# EAGLE design rev2 (EAGLE 7.1.0)
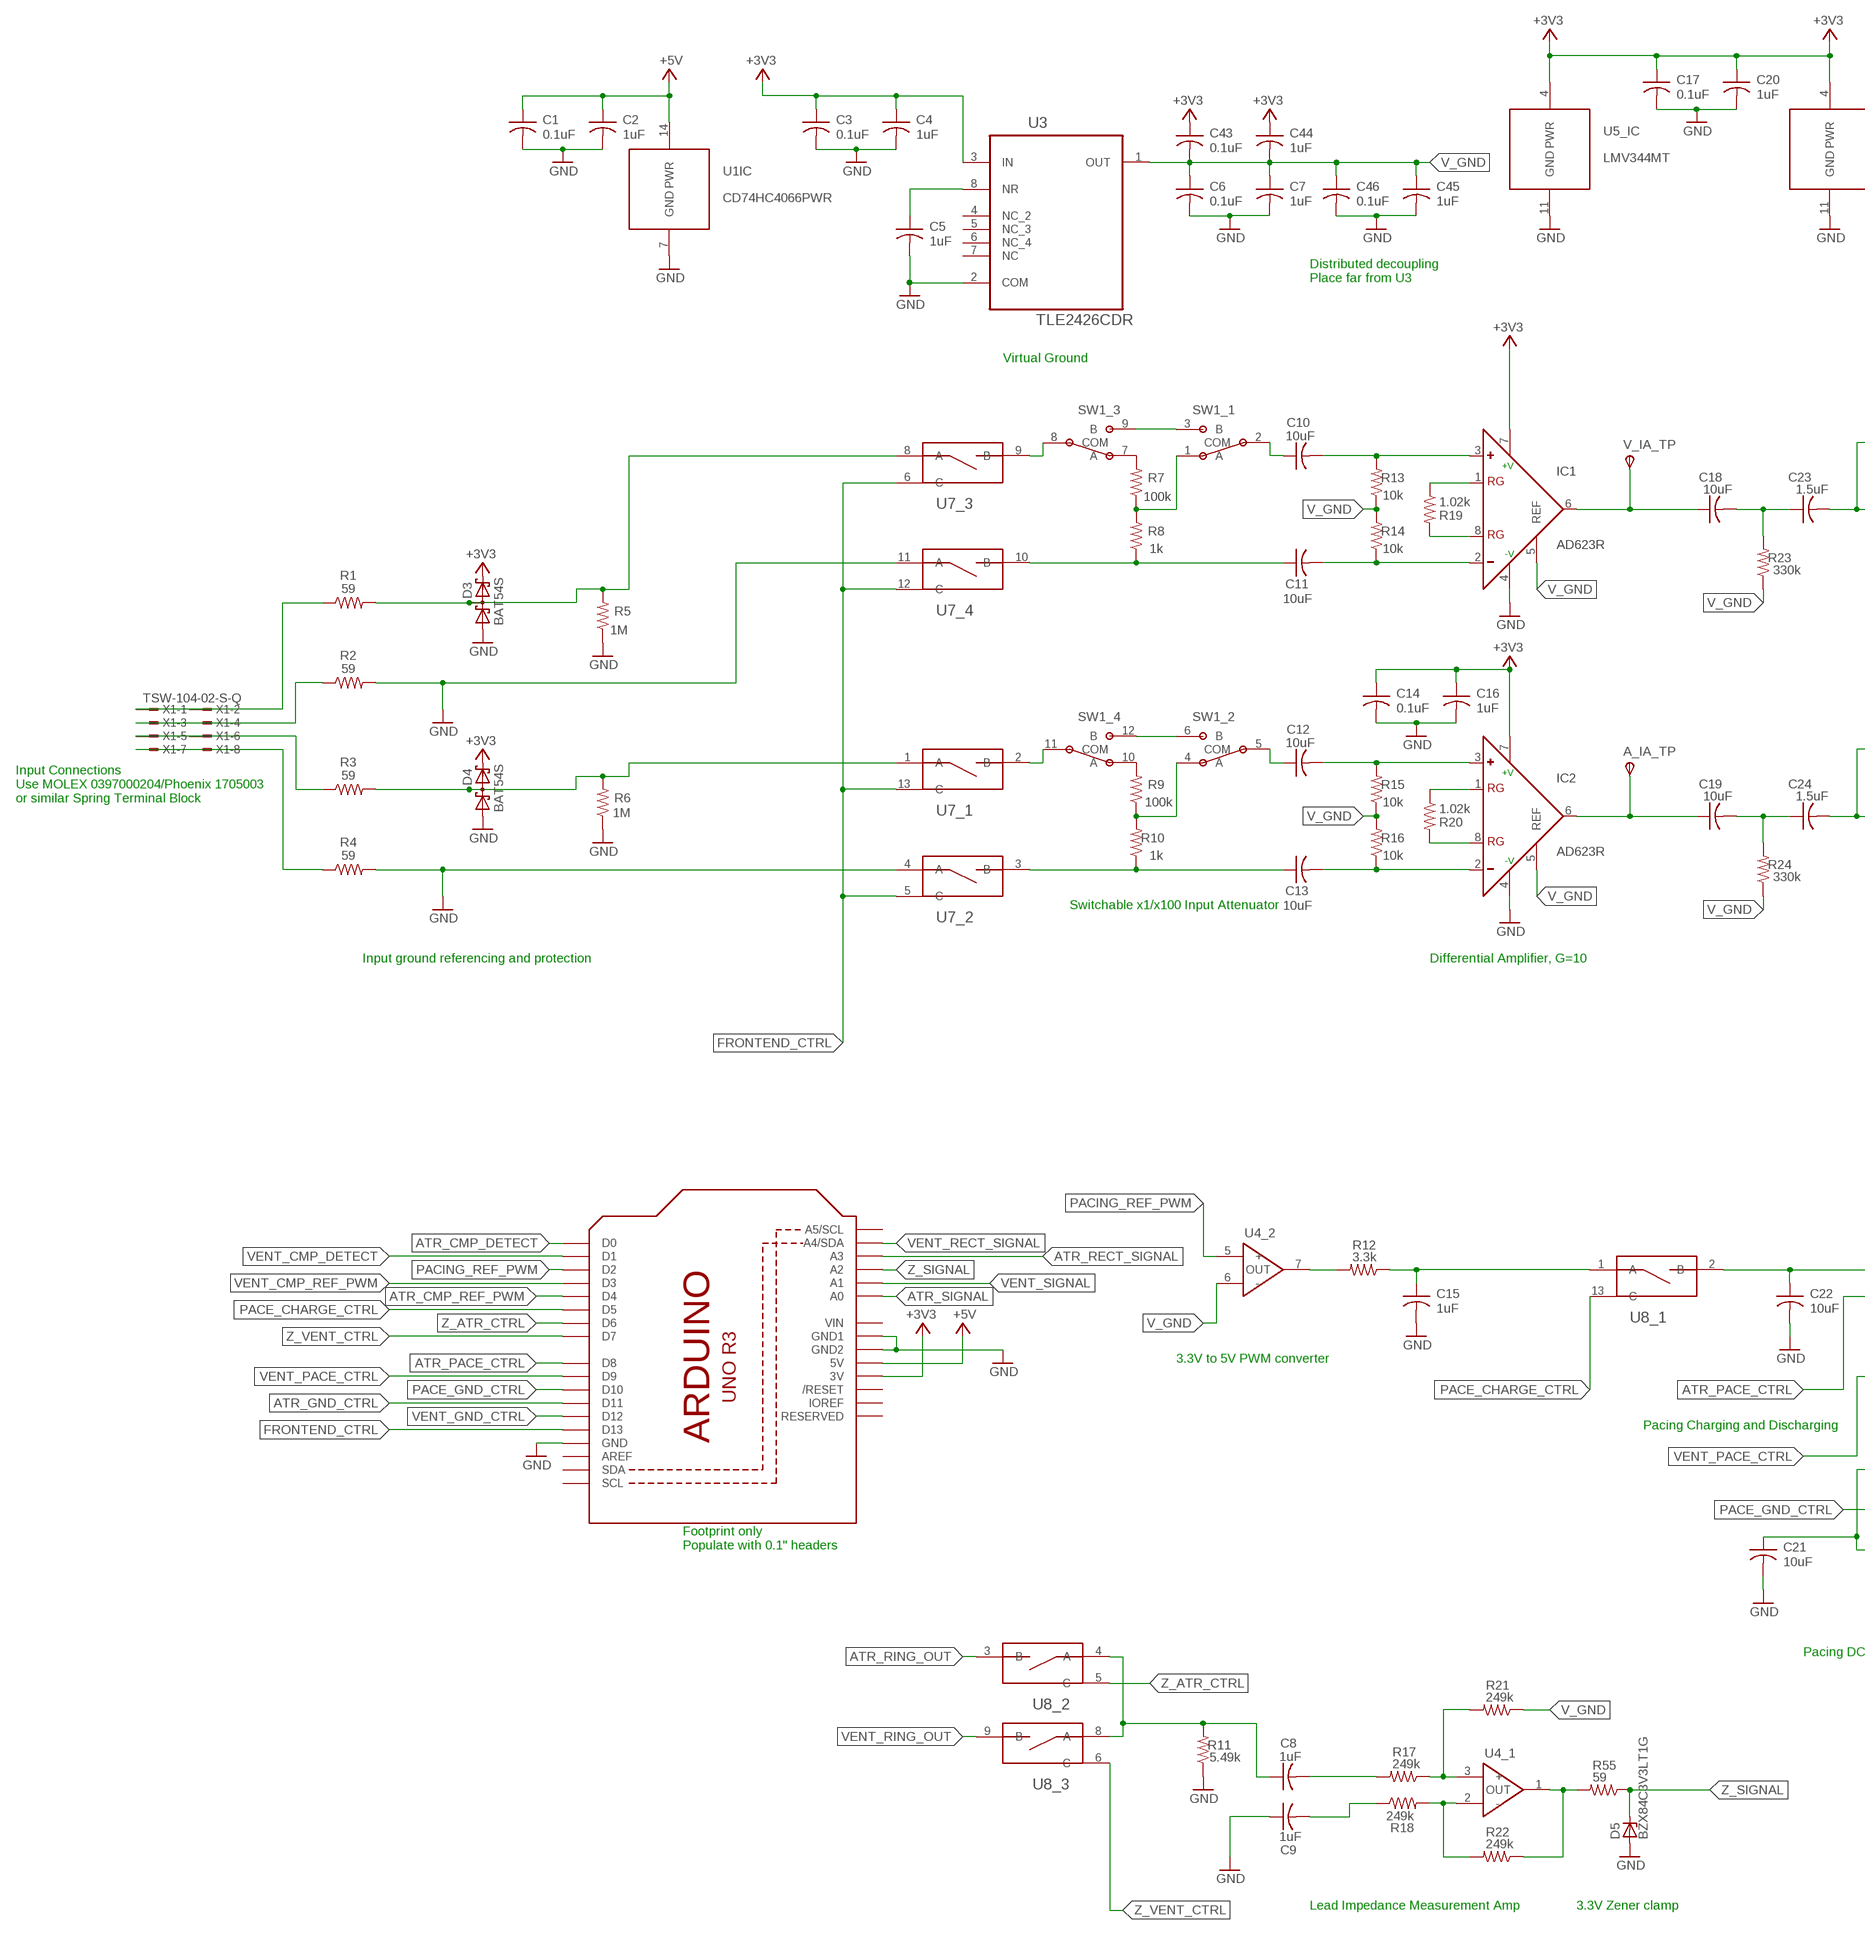
[diagram p0: schematic, sheet 1, part 1 of 2]
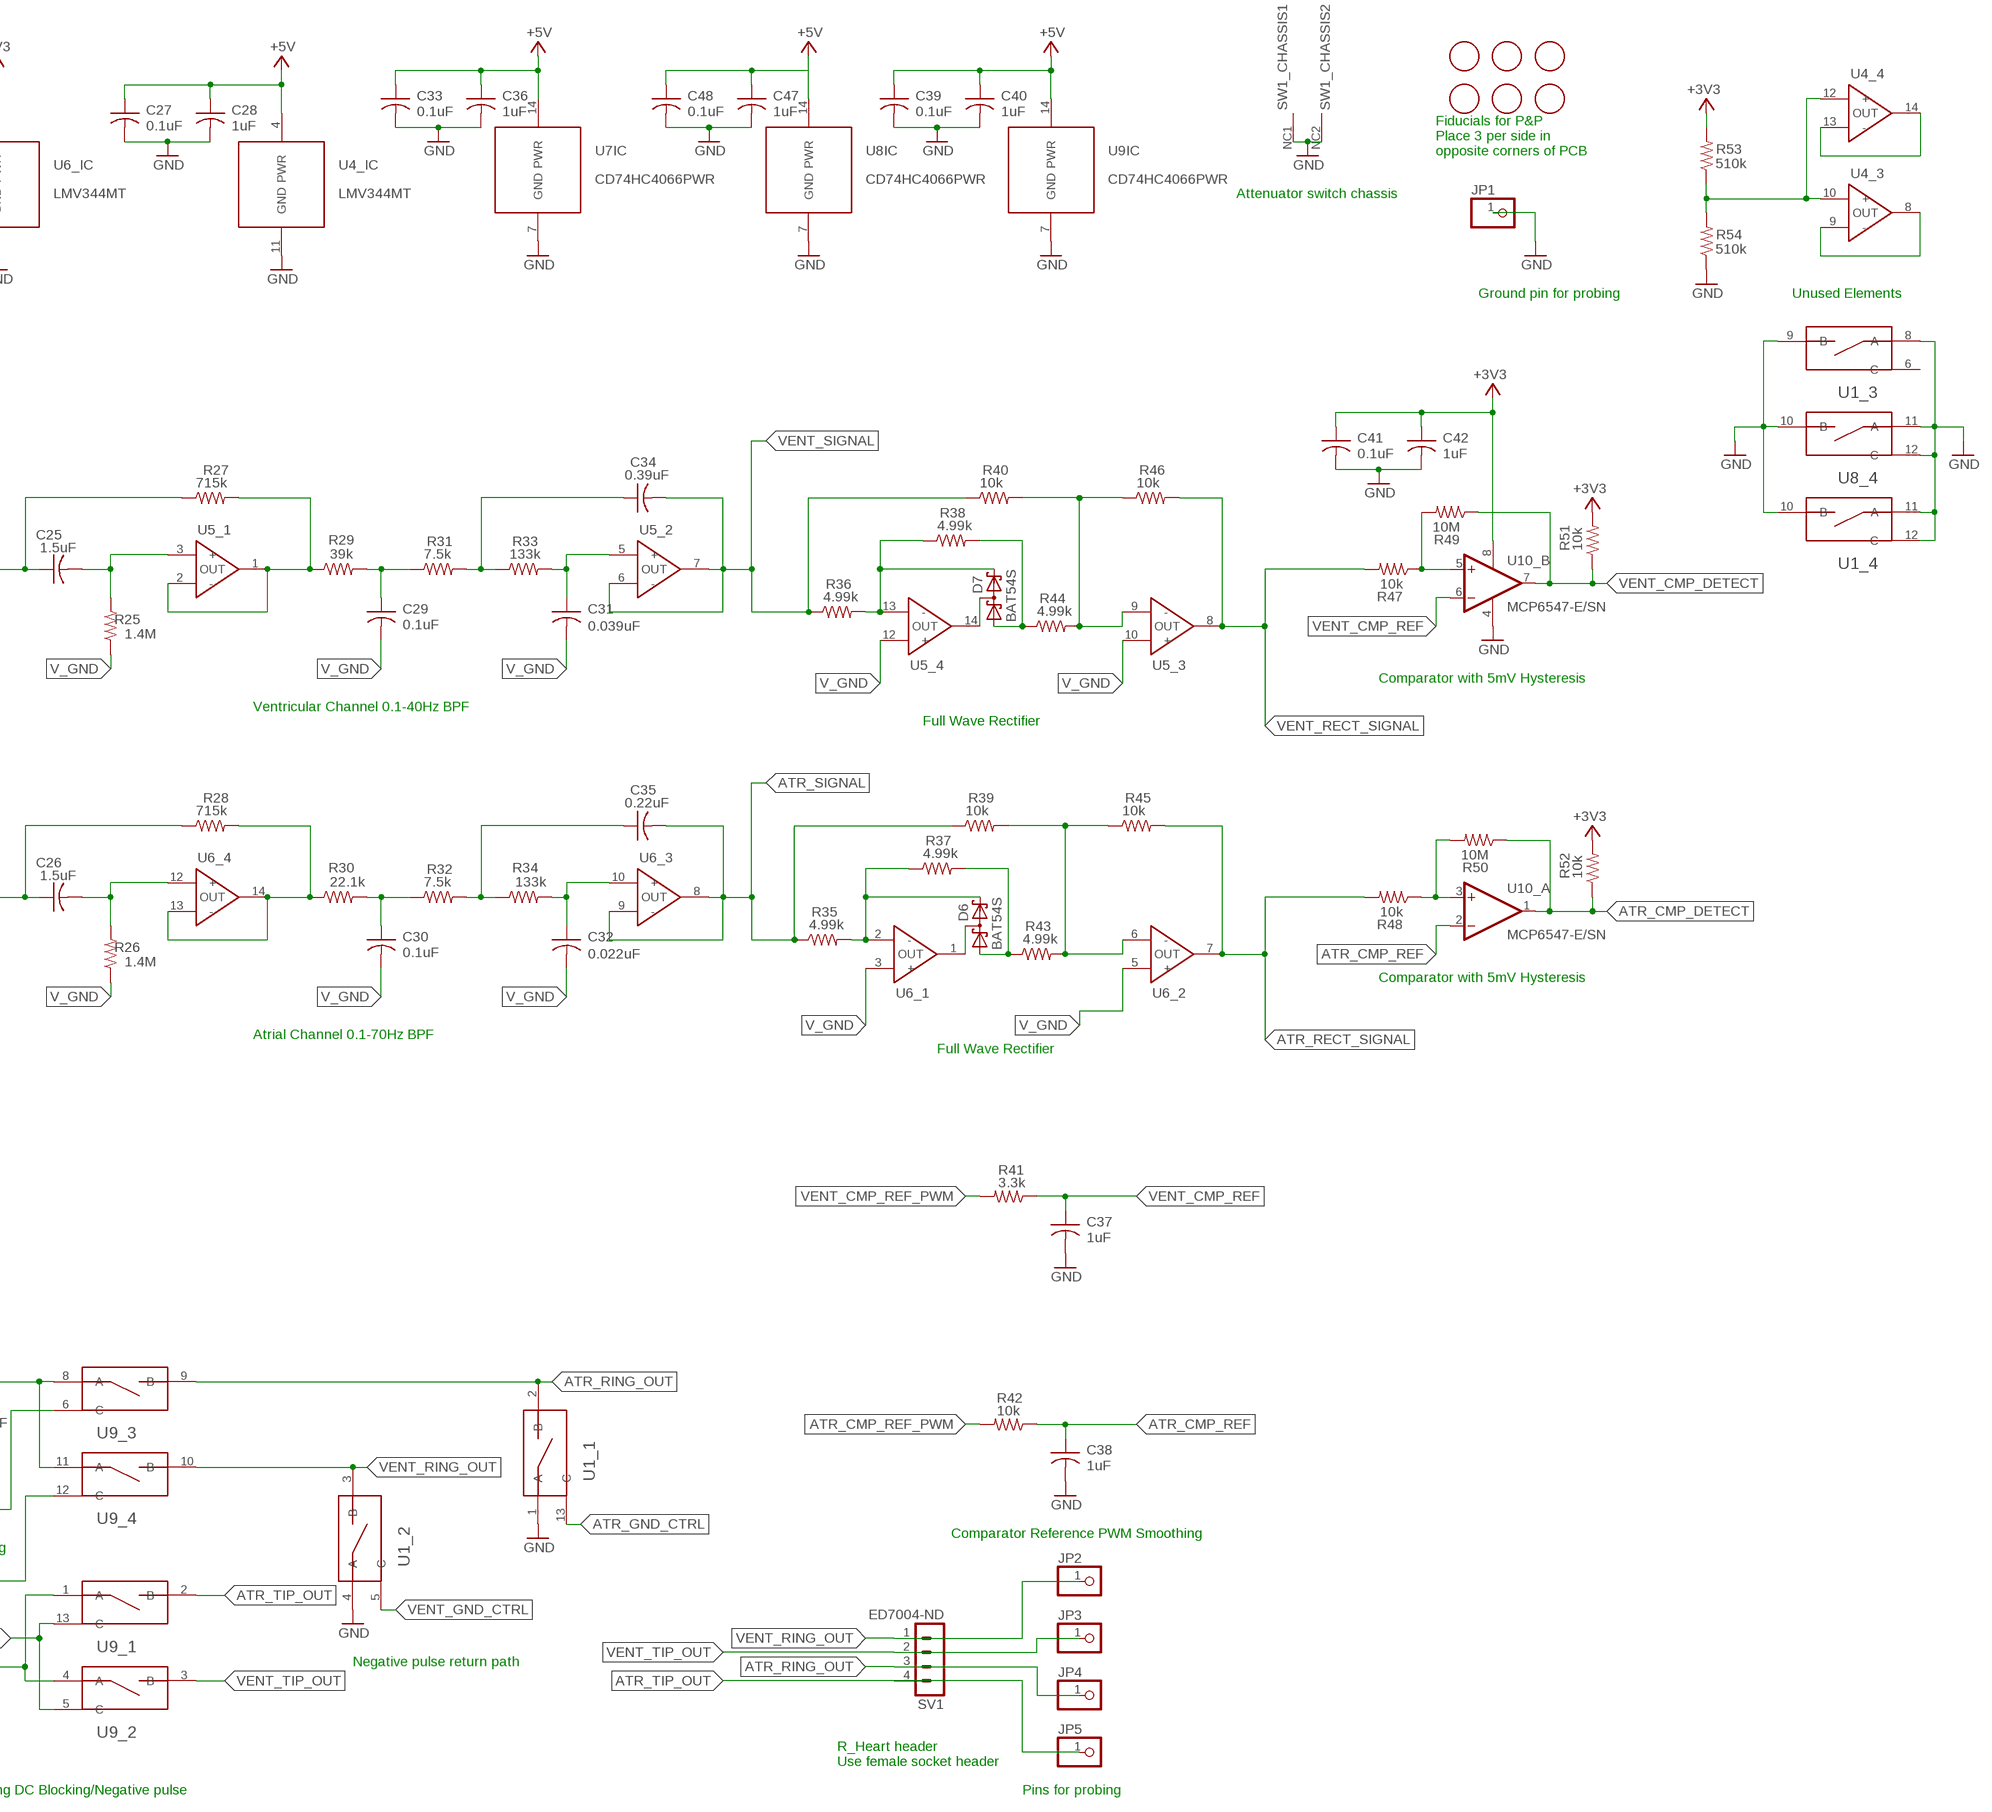
[diagram p1: schematic, sheet 1, part 2 of 2]

## Parts
A_IA_TP  TPSTP06R  [TP06R]
C1  0.1uF  C-USC0805  [C0805]
C2  1uF  C-USC0805  [C0805]
C3  0.1uF  C-USC0805  [C0805]
C4  1uF  C-USC0805  [C0805]
C5  1uF  C-USC0805  [C0805]
C6  0.1uF  C-USC0805  [C0805]
C7  1uF  C-USC0805  [C0805]
C8  1uF  C-USC0805  [C0805]
C9  1uF  C-USC0805  [C0805]
C10  10uF  C-USC0805  [C0805]
C11  10uF  C-USC0805  [C0805]
C12  10uF  C-USC0805  [C0805]
C13  10uF  C-USC0805  [C0805]
C14  0.1uF  C-USC0805  [C0805]
C15  1uF  C-USC0805  [C0805]
C16  1uF  C-USC0805  [C0805]
C17  0.1uF  C-USC0805  [C0805]
C18  10uF  C-USC0805  [C0805]
C19  10uF  C-USC0805  [C0805]
C20  1uF  C-USC0805  [C0805]
C21  10uF  C-USC0805  [C0805]
C22  10uF  C-USC0805  [C0805]
C23  1.5uF  C-USC0805  [C0805]
C24  1.5uF  C-USC0805  [C0805]
C25  1.5uF  C-USC0805  [C0805]
C26  1.5uF  C-USC0805  [C0805]
C27  0.1uF  C-USC0805  [C0805]
C28  1uF  C-USC0805  [C0805]
C29  0.1uF  C-USC0805  [C0805]
C30  0.1uF  C-USC0805  [C0805]
C31  0.039uF  C-USC0805  [C0805]
C32  0.022uF  C-USC0805  [C0805]
C33  0.1uF  C-USC0805  [C0805]
C34  0.39uF  C-USC0805  [C0805]
C35  0.22uF  C-USC0805  [C0805]
C36  1uF  C-USC0805  [C0805]
C37  1uF  C-USC0805  [C0805]
C38  1uF  C-USC0805  [C0805]
C39  0.1uF  C-USC0805  [C0805]
C40  1uF  C-USC0805  [C0805]
C41  0.1uF  C-USC0805  [C0805]
C42  1uF  C-USC0805  [C0805]
C43  0.1uF  C-USC0805  [C0805]
C44  1uF  C-USC0805  [C0805]
C45  1uF  C-USC0805  [C0805]
C46  0.1uF  C-USC0805  [C0805]
C47  1uF  C-USC0805  [C0805]
C48  0.1uF  C-USC0805  [C0805]
D3  BAT54S  [SOT23]
D4  BAT54S  [SOT23]
D5  BZX84C3V3LT1G  ZENER-DIODESOT23  [SOT23]
D6  BAT54S  [SOT23]
D7  BAT54S  [SOT23]
IC1  AD623R  [SO8]
IC2  AD623R  [SO8]
JP1  PINHD-1X1  [1X01]
JP2  PINHD-1X1  [1X01]
JP3  PINHD-1X1  [1X01]
JP4  PINHD-1X1  [1X01]
JP5  PINHD-1X1  [1X01]
R1  59  R-US_R0805  [R0805]
R2  59  R-US_R0805  [R0805]
R3  59  R-US_R0805  [R0805]
R4  59  R-US_R0805  [R0805]
R5  1M  R-US_R0805  [R0805]
R6  1M  R-US_R0805  [R0805]
R7  100k  R-US_R0805  [R0805]
R8  1k  R-US_R0805  [R0805]
R9  100k  R-US_R0805  [R0805]
R10  1k  R-US_R0805  [R0805]
R11  5.49k  R-US_R0805  [R0805]
R12  3.3k  R-US_R0805  [R0805]
R13  10k  R-US_R0805  [R0805]
R14  10k  R-US_R0805  [R0805]
R15  10k  R-US_R0805  [R0805]
R16  10k  R-US_R0805  [R0805]
R17  249k  R-US_R0805  [R0805]
R18  249k  R-US_R0805  [R0805]
R19  1.02k  R-US_R0805  [R0805]
R20  1.02k  R-US_R0805  [R0805]
R21  249k  R-US_R0805  [R0805]
R22  249k  R-US_R0805  [R0805]
R23  330k  R-US_R0805  [R0805]
R24  330k  R-US_R0805  [R0805]
R25  1.4M  R-US_R0805  [R0805]
R26  1.4M  R-US_R0805  [R0805]
R27  715k  R-US_R0805  [R0805]
R28  715k  R-US_R0805  [R0805]
R29  39k  R-US_R0805  [R0805]
R30  22.1k  R-US_R0805  [R0805]
R31  7.5k  R-US_R0805  [R0805]
R32  7.5k  R-US_R0805  [R0805]
R33  133k  R-US_R0805  [R0805]
R34  133k  R-US_R0805  [R0805]
R35  4.99k  R-US_R0805  [R0805]
R36  4.99k  R-US_R0805  [R0805]
R37  4.99k  R-US_R0805  [R0805]
R38  4.99k  R-US_R0805  [R0805]
R39  10k  R-US_R0805  [R0805]
R40  10k  R-US_R0805  [R0805]
R41  3.3k  R-US_R0805  [R0805]
R42  10k  R-US_R0805  [R0805]
R43  4.99k  R-US_R0805  [R0805]
R44  4.99k  R-US_R0805  [R0805]
R45  10k  R-US_R0805  [R0805]
R46  10k  R-US_R0805  [R0805]
R47  10k  R-US_R0805  [R0805]
R48  10k  R-US_R0805  [R0805]
R49  10M  R-US_R0805  [R0805]
R50  10M  R-US_R0805  [R0805]
R51  10k  R-US_R0805  [R0805]
R52  10k  R-US_R0805  [R0805]
R53  510k  R-US_R0805  [R0805]
R54  510k  R-US_R0805  [R0805]
R55  59  R-US_R0805  [R0805]
SV1  ED7004-ND  MA04-1  [MA04-1]
SW1  EG4208  [EG4208-PACKAGE]
U1  CD74HC4066PWR  [SOP65P640X110-14N]
U2  ARDUINOR3-DIMENSION  [ARDUINOR3]
U3  TLE2426CDR  [SOIC127P600X175-8N]
U4  LMV344MT  [SOP65P640X110-14N]
U5  LMV344MT  [SOP65P640X110-14N]
U6  LMV344MT  [SOP65P640X110-14N]
U7  CD74HC4066PWR  [SOP65P640X110-14N]
U8  CD74HC4066PWR  [SOP65P640X110-14N]
U9  CD74HC4066PWR  [SOP65P640X110-14N]
U10  MCP6547-E/SN  [SOIC127P600X175-8N]
U$1  FIDUCIAL  [FIDUCIAL_1MM]
U$2  FIDUCIAL  [FIDUCIAL_1MM]
U$3  FIDUCIAL  [FIDUCIAL_1MM]
U$4  FIDUCIAL  [FIDUCIAL_1MM]
U$5  FIDUCIAL  [FIDUCIAL_1MM]
U$6  FIDUCIAL  [FIDUCIAL_1MM]
V_IA_TP  TPSTP06R  [TP06R]
X1  TSW-104-02-S-Q  [TSW-104-02-S-Q]

## Nets
+3V3: C3.1 C4.1 C14.1 C16.1 C17.1 C20.1 C41.1 C42.1 C43.1 C44.1 D3.2(C2) D4.2(C2) IC1.7(+V) IC2.7(+V) R51.2 R52.2 R53.2 U2.3V U3.3(IN) U5.4(_IC:PWR) U6.4(_IC:PWR) U10.8(_B:V+)
+5V: C1.1 C2.1 C27.1 C28.1 C33.1 C36.1 C39.1 C40.1 C47.1 C48.1 U1.14(IC:PWR) U2.5V U4.4(_IC:PWR) U7.14(IC:PWR) U8.14(IC:PWR) U9.14(IC:PWR)
ATR_CMP_DETECT: R50.1 R52.1 U2.D0 U10.1(_A:OUT)
ATR_CMP_REF: C38.1 R42.1 U10.2(_A:-IN)
ATR_CMP_REF_PWM: R42.2 U2.D4
ATR_GND_CTRL: U1.13(_1:C) U2.D11
ATR_PACE_CTRL: U2.D8 U9.6(_3:C)
ATR_RECT_SIGNAL: R45.2 R48.2 U2.A3 U6.7(_2:OUT)
ATR_RING: D4.3(C1A2) R3.2 R6.2 U7.1(_1:A)
ATR_RING_OUT: JP4.1 SV1.3 U1.2(_1:B) U8.3(_2:B) U9.9(_3:B)
ATR_SIGNAL: C35.2 R35.1 R39.1 U2.A0 U6.8(_3:OUT) U6.9(_3:-)
ATR_TIP_OUT: JP5.1 SV1.4 U9.2(_1:B)
FRONTEND_CTRL: U2.D13 U7.5(_2:C) U7.6(_3:C) U7.12(_4:C) U7.13(_1:C)
GND: C1.2 C2.2 C3.2 C4.2 C5.2 C6.2 C7.2 C9.1 C14.2 C15.2 C16.2 C17.2 C20.2 C21.2 C22.2 C27.2 C28.2 C33.2 C36.2 C37.2 C38.2 C39.2 C40.2 C41.2 C42.2 C45.2 C46.2 C47.2 C48.2 D3.1(A1) D4.1(A1) D5.1(A) IC1.4(-V) IC2.4(-V) JP1.1 R2.2 R4.2 R5.1 R6.1 R11.1 R54.1 SW1.NC1(_CHASSIS1:V-) SW1.NC2(_CHASSIS2:V-) U1.1(_1:A) U1.4(_2:A) U1.7(IC:GND) U1.8(_3:A) U1.9(_3:B) U1.10(_4:B) U1.11(_4:A) U1.12(_4:C) U2.GND U2.GND1 U2.GND2 U3.2(COM) U4.11(_IC:GND) U5.11(_IC:GND) U6.11(_IC:GND) U7.4(_2:A) U7.7(IC:GND) U7.11(_4:A) U8.7(IC:GND) U8.10(_4:B) U8.11(_4:A) U8.12(_4:C) U9.7(IC:GND) U10.4(_B:V-)
N$1: C10.2 IC1.3(+) R13.2
N$2: C11.2 IC1.2(-) R14.1
N$3: C18.1 IC1.6(OUT) V_IA_TP.TP(PP)
N$4: IC1.1(RG) R19.1
N$5: R7.2 SW1.7(_3:A)
N$6: C18.2 C23.1 R23.2
N$7: C23.2 C25.1 R27.1
N$8: C11.1 R8.1 U7.10(_4:B)
N$9: C13.2 IC2.2(-) R16.1
N$10: C29.1 R29.2 R31.1
N$11: C34.1 R31.2 R33.1
N$12: C13.1 R10.1 U7.3(_2:B)
N$13: D6.2(C2) R35.2 R37.1 U6.2(_1:-)
N$15: R9.2 SW1.10(_4:A)
N$16: IC2.1(RG) R20.1
N$17: IC2.8(RG) R20.2
N$18: C19.2 C24.1 R24.2
N$19: D6.3(C1A2) U6.1(_1:OUT)
N$20: IC1.8(RG) R19.2
N$21: C12.2 IC2.3(+) R15.2
N$24: C15.1 R12.1 U8.1(_1:A)
N$25: C21.1 U9.1(_1:A) U9.4(_2:A)
N$26: R22.1 R55.2 U4.1(_1:OUT)
N$27: D7.3(C1A2) U5.14(_4:OUT)
N$28: R28.2 R30.1 U6.13(_4:-) U6.14(_4:OUT)
N$29: SW1.6(_2:B) SW1.12(_4:B)
N$30: C24.2 C26.1 R28.1
N$31: C22.1 U8.2(_1:B) U9.8(_3:A) U9.11(_4:A)
N$32: C25.2 R25.2 U5.3(_1:+)
N$33: R27.2 R29.1 U5.1(_1:OUT) U5.2(_1:-)
N$34: C5.1 U3.8(NR)
N$36: C31.1 R33.2 U5.5(_2:+)
N$40: C30.1 R30.2 R32.1
N$41: R48.1 R50.2 U10.3(_A:+IN)
N$42: C35.1 R32.2 R34.1
N$44: D6.1(A1) R37.2 R43.1
N$45: C26.2 R26.2 U6.12(_4:+)
N$46: R47.1 R49.2 U10.5(_B:+IN)
N$48: C32.1 R34.2 U6.10(_3:+)
N$49: R39.2 R43.2 R45.1 U6.6(_2:-)
N$51: SW1.3(_1:B) SW1.9(_3:B)
N$53: C8.1 R11.2 U8.4(_2:A) U8.8(_3:A)
N$54: A_IA_TP.TP(PP) C19.1 IC2.6(OUT)
N$55: U4.8(_3:OUT) U4.9(_3:-)
N$56: R12.2 U4.7(_2:OUT)
N$57: R17.1 R21.2 U4.3(_1:+)
N$58: R18.2 R22.2 U4.2(_1:-)
N$59: C9.2 R18.1
N$60: C8.2 R17.2
N$61: U4.13(_4:-) U4.14(_4:OUT)
N$62: R53.1 R54.2 U4.10(_3:+) U4.12(_4:+)
N$82: R4.1 X1.7 X1.8
N$83: R2.1 X1.3 X1.4
N$84: R3.1 X1.5 X1.6
N$85: R7.1 R8.2 SW1.1(_1:A)
N$86: R1.1 X1.1 X1.2
N$88: SW1.8(_3:COM) U7.9(_3:B)
N$89: SW1.11(_4:COM) U7.2(_1:B)
N$90: R9.1 R10.2 SW1.4(_2:A)
N$91: D7.2(C2) R36.2 R38.1 U5.13(_4:-)
N$92: C12.1 SW1.5(_2:COM)
N$93: C10.1 SW1.2(_1:COM)
N$94: D7.1(A1) R38.2 R44.1
N$96: R40.2 R44.2 R46.1 U5.9(_3:-)
PACE_CHARGE_CTRL: U2.D5 U8.13(_1:C)
PACE_GND_CTRL: U2.D10 U9.5(_2:C) U9.13(_1:C)
PACING_REF_PWM: U2.D2 U4.5(_2:+)
V_GND: C6.1 C7.1 C29.2 C30.2 C31.2 C32.2 C43.2 C44.2 C45.1 C46.1 IC1.5(REF) IC2.5(REF) R13.1 R14.2 R15.1 R16.2 R21.1 R23.1 R24.1 R25.1 R26.1 U3.1(OUT) U4.6(_2:-) U5.10(_3:+) U5.12(_4:+) U6.3(_1:+) U6.5(_2:+)
VENT_CMP_DETECT: R49.1 R51.1 U2.D1 U10.7(_B:OUT)
VENT_CMP_REF: C37.1 R41.1 U10.6(_B:-IN)
VENT_CMP_REF_PWM: R41.2 U2.D3
VENT_GND_CTRL: U1.5(_2:C) U2.D12
VENT_PACE_CTRL: U2.D9 U9.12(_4:C)
VENT_RECT_SIGNAL: R46.2 R47.2 U2.A4(A4/SDA) U5.8(_3:OUT)
VENT_RING: D3.3(C1A2) R1.2 R5.2 U7.8(_3:A)
VENT_RING_OUT: JP2.1 SV1.1 U1.3(_2:B) U8.9(_3:B) U9.10(_4:B)
VENT_SIGNAL: C34.2 R36.1 R40.1 U2.A1 U5.6(_2:-) U5.7(_2:OUT)
VENT_TIP_OUT: JP3.1 SV1.2 U9.3(_2:B)
Z_ATR_CTRL: U2.D6 U8.5(_2:C)
Z_SIGNAL: D5.3(C) R55.1 U2.A2
Z_VENT_CTRL: U2.D7 U8.6(_3:C)
Unconnected: U1.6(_3:C) U2.A5(A5/SCL) U2.AREF U2.IOREF U2.RESERVED U2.RESET(/RESET) U2.SCL U2.SDA U3.4(NC_2) U3.5(NC_3) U3.6(NC_4) U3.7(NC)

## Notes on the sheet
- Fiducials for P&P
  Place 3 per side in 
  opposite corners of PCB
- Attenuator switch chassis
- Ground pin for probing | Unused Elements
- Distributed decoupling
  Place far from U3
- Virtual Ground
- Comparator with 5mV Hysteresis
- Ventricular Channel 0.1-40Hz BPF
- Full Wave Rectifier
- Input Connections
  Use MOLEX 0397000204/Phoenix 1705003
  or similar Spring Terminal Block
- Comparator with 5mV Hysteresis
- Switchable x1/x100 Input Attenuator
- Atrial Channel 0.1-70Hz BPF
- Input ground referencing and protection | Differential Amplifier, G=10 | Full Wave Rectifier
- 3.3V to 5V PWM converter
- Comparator Reference PWM Smoothing
- Pacing Charging and Discharging
- Negative pulse return path
- Footprint only
  Populate with 0.1" headers
- R_Heart header
  Use female socket header
- Pacing DC Blocking/Negative pulse | Pins for probing
- Lead Impedance Measurement Amp | 3.3V Zener clamp

## Power pins joined to a net without a drawn wire
VIN: U2.VIN

## Library data of the parts
A_IA_TP V_IA_TP = testpad:TPS: TEST PIN
C1-C48 = adafruit:C-US: CAPACITOR, American symbol
D3 D4 D6 D7 = diode:BAT54S: Schottky Diodes Pin connection corrected 2011-05-04 Source: Fairchild .. BAT54.pdf
D5 = diode:ZENER-DIODE: Z-Diode
IC1 IC2 = analog-devices:AD623: Single-Supply, Rail-to-Rail, Low Cost Instrumentation Amplifier Source: http://www.analog.com/static/imported-files/data_sheets/AD623.pdf; MPN: AD623ARZ.; OC_FARNELL: 9426213; OC_NEWARK: 31M4186
JP1-JP5 = pinhead:PINHD-1X1: PIN HEADER
R1-R55 = adafruit:R-US_: RESISTOR, American symbol
SV1 = con-lstb:MA04-1: PIN HEADER; OC_FARNELL: unknown; OC_NEWARK: unknown
SW1 = semi_custom_parts:EG4208
U1 U7-U9 = semi_custom_parts:CD74HC4066PWR
U2 = adafruit:ARDUINOR3: This is a new object for the new Arduino R3 - with extra pins that you may want to use (such as IOref, and duplicated A4/A5
U3 = Texas Instruments_By_element14_Batch_1:TLE2426CDR: Precision Virtual Ground; MPN: TLE2426CDR; OC_FARNELL: 1575632; OC_NEWARK: 76C7712; PACKAGE: SOIC-8; SUPPLIER: Texas Instruments
U4-U6 = semi_custom_parts:LMV344MT
U10 = semi_custom_parts:MCP6547-E/SN: Open-Drain Output Sub-Microamp Comparators; MPN: MCP6547-E/SN; OC_FARNELL: -; OC_NEWARK: 71J5347; PACKAGE: SOIC-8; SUPPLIER: Microchip
U$1-U$6 = adafruit:FIDUCIAL: For use by pick and place machines to calibrate the vision/machine, 1mm By microbuilder.eu
X1 = con-samtec:TSW-104-02-S-Q: THROUGH-HOLE .025" SQ POST HEADER Source: Samtec TSW.pdf; OC_FARNELL: unknown; OC_NEWARK: unknown

## Board
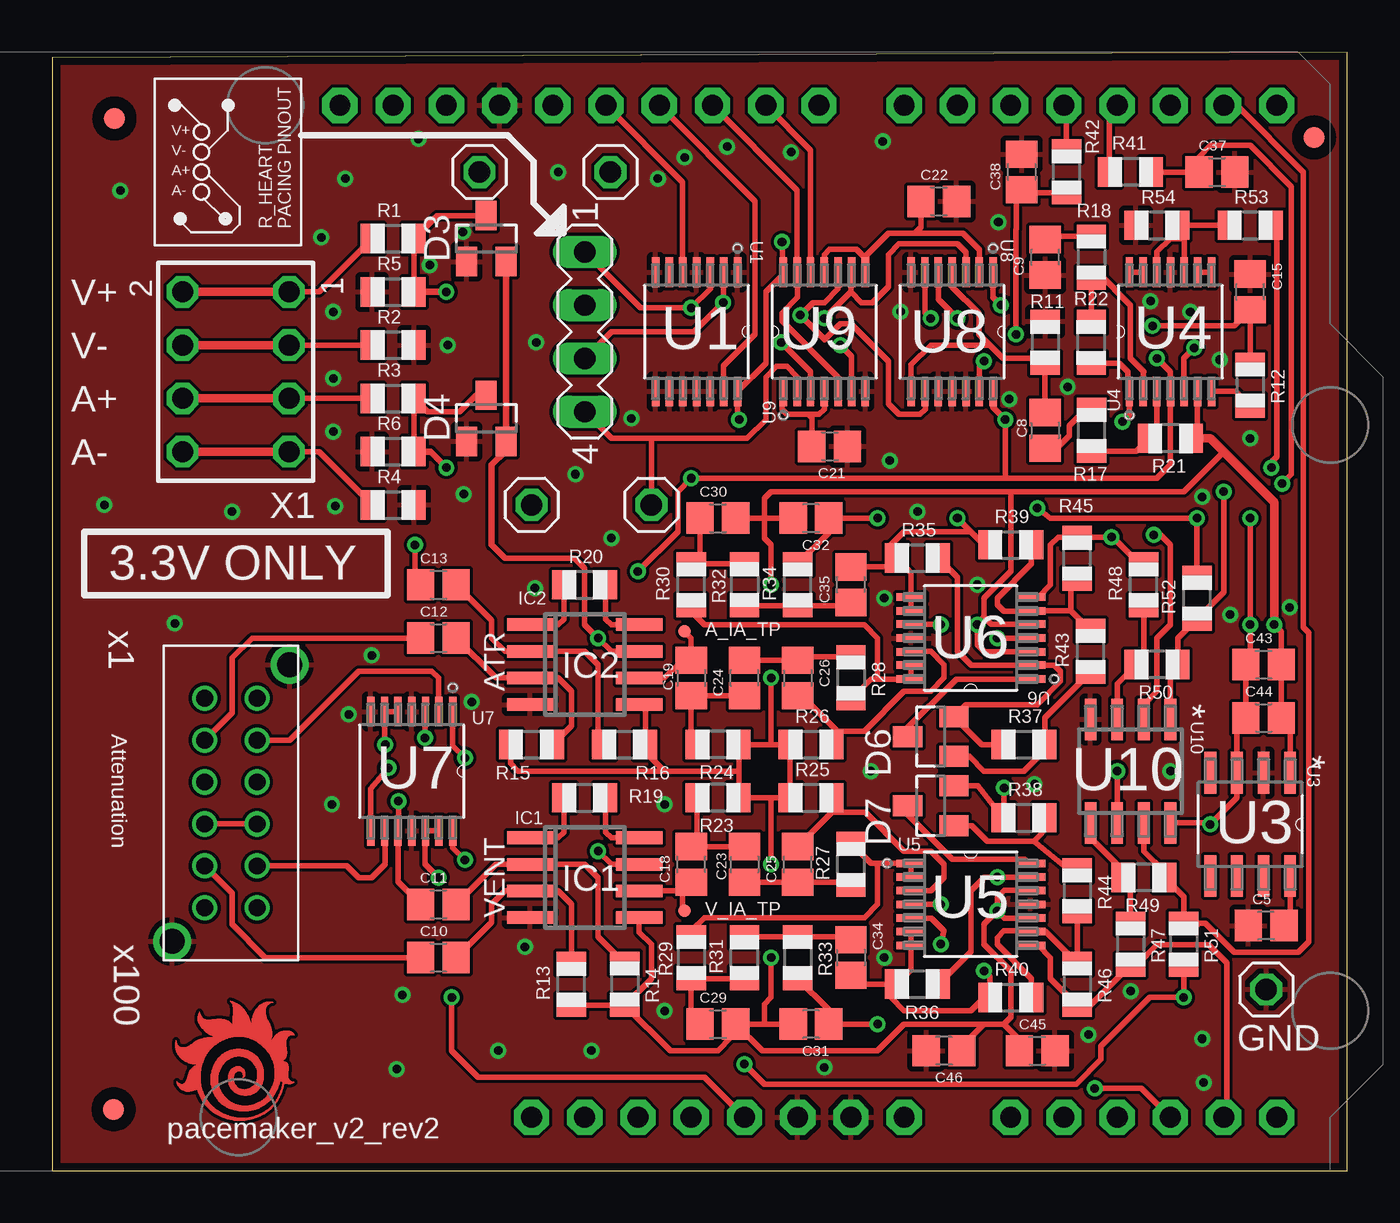
[diagram p2: board, top side]
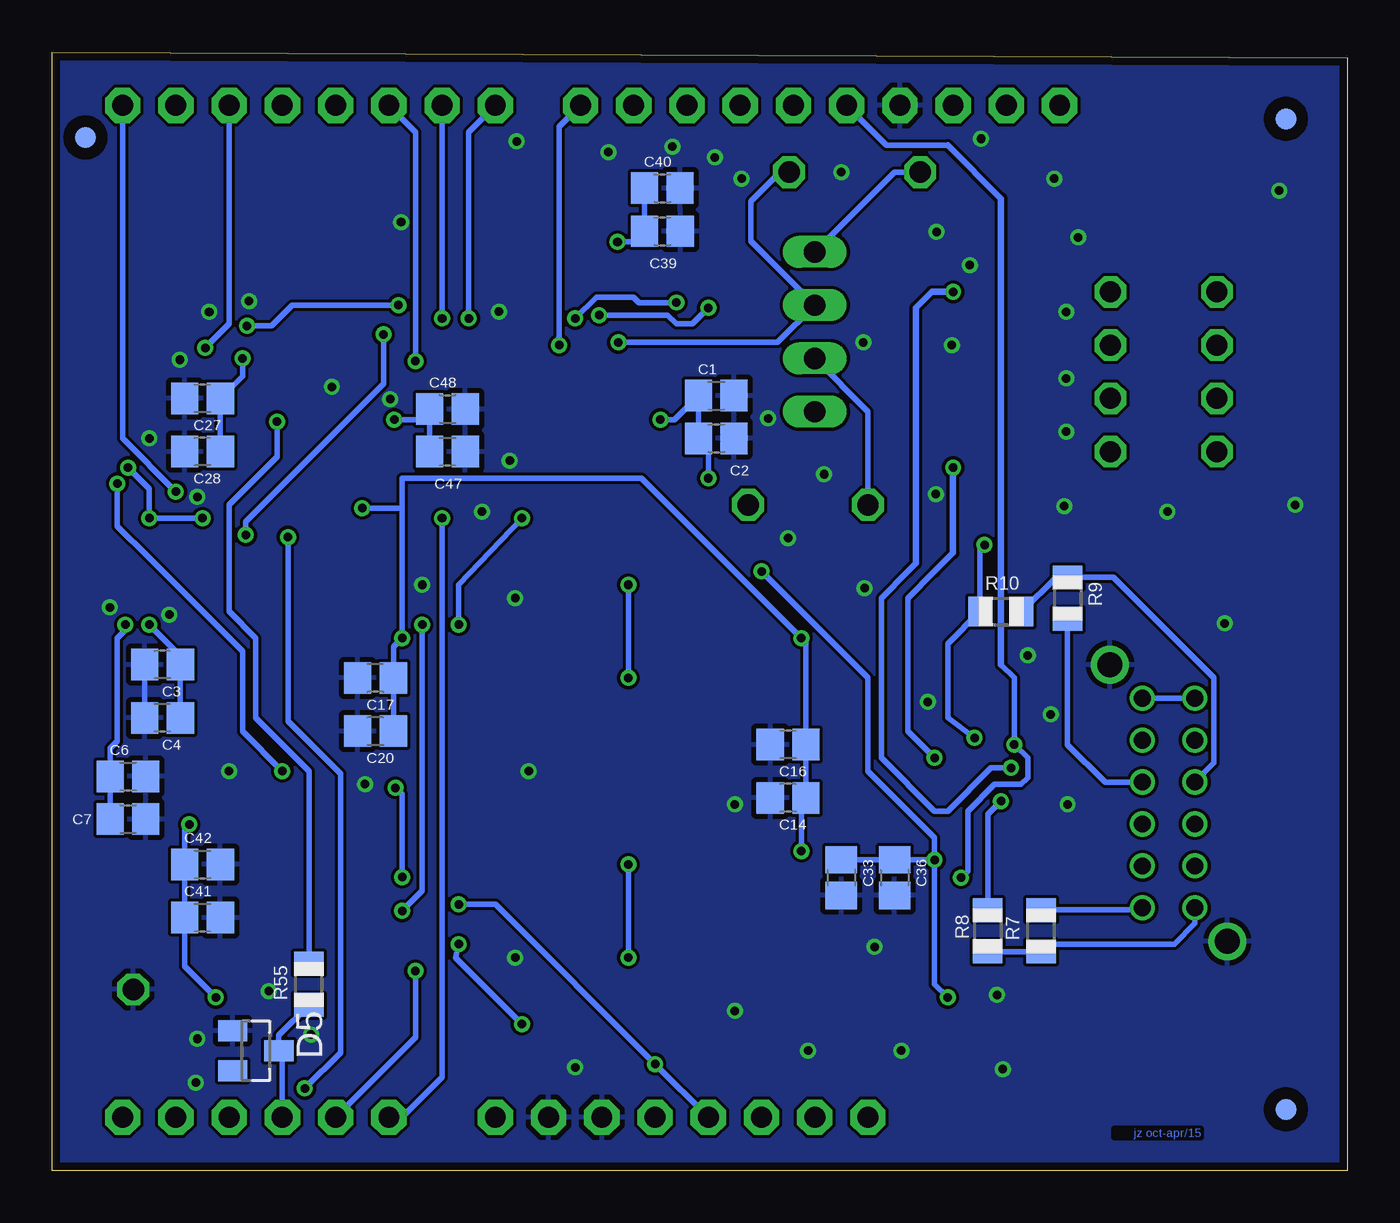
[diagram p3: board, bottom side, seen from below]

Size 61.77 x 53.33 mm. Coordinates in mm from the lower left corner, seen from the top.
Outline: 0,0 61.77,0 61.77,53.33 0,53.08 0,0
Copper layers (1*16): Top 0.0356mm / dielectric 1.5011mm / Bottom 0.0356mm
Design rules "oshpark-2layer *": minimum track width 6mil, minimum drill 13mil, track to track 6mil, track to pad 6mil, pad to pad 6mil, via to via 6mil, smd to smd 6mil, copper to edge 15mil, drill to drill 6mil, minimum pad ring 7mil, minimum via ring 7mil, stop-mask expansion 4mil, vias tented up to drill 100mil, thermal gap 10mil

### Footprints (pad centres in the part's own frame; a part is rotated, then mirrored left to right if it is on the bottom)
TP06R = smd 0.6 x 0.6: TP 0,0
C0805 = smd 1.3 x 1.5: 1 -0.85,0; 2 0.85,0
SOT23 = smd 1 x 1.4: 1 -0.95,-1.1; 2 0.95,-1.1; 3 0,1.1
SO8 = smd 0.6 x 2.2: 1 -1.905,-2.6; 2 -0.635,-2.6; 3 0.635,-2.6; 4 1.905,-2.6; 5 1.905,2.6; 6 0.635,2.6; 7 -0.635,2.6; 8 -1.905,2.6
1X01 = drill 1.016 octagon: 1 0,0
R0805 = smd 1.1 x 1.4: 1 -1,0; 2 1,0
MA04-1 = drill 1.016 long: 1 -3.81,0; 2 -1.27,0; 3 1.27,0; 4 3.81,0
EG4208-PACKAGE = drill 0.8: 1 -1.55,11.6; 2 -1.55,9.6; 3 -1.55,7.6; 4 -1.55,5.6; 5 -1.55,3.6; 6 -1.55,1.6; 7 -4.05,11.6; 8 -4.05,9.6; 9 -4.05,7.6; 10 -4.05,5.6; 11 -4.05,3.6; 12 -4.05,1.6 | drill 1.2: NC1 0,13.2; NC2 -5.6,0
SOP65P640X110-14N = smd 1.422 x 0.356: 1 -2.845,1.956; 2 -2.845,1.295; 3 -2.845,0.66; 4 -2.845,0; 5 -2.845,-0.66; 6 -2.845,-1.295; 7 -2.845,-1.956; 8 2.845,-1.956; 9 2.845,-1.295; 10 2.845,-0.66; 11 2.845,0; 12 2.845,0.66; 13 2.845,1.295; 14 2.845,1.956
ARDUINOR3 = drill 1 pad 1.676 octagon: 3V 35.56,2.54; 5V 38.1,2.54; A0 50.8,2.54; A1 53.34,2.54; A2 55.88,2.54; A3 58.42,2.54; A4 60.96,2.54; A5 63.5,2.54; AREF 23.876,50.8; D0 63.5,50.8; D1 60.96,50.8; D2 58.42,50.8; D3 55.88,50.8; D4 53.34,50.8; D5 50.8,50.8; D6 48.26,50.8; D7 45.72,50.8; D8 41.656,50.8; D9 39.116,50.8; D10 36.576,50.8; D11 34.036,50.8; D12 31.496,50.8; D13 28.956,50.8; GND 26.416,50.8; GND1 43.18,2.54; GND2 40.64,2.54; IOREF 30.48,2.54; RESERVED 27.94,2.54; RESET 33.02,2.54; SCL 18.796,50.8; SDA 21.336,50.8; VIN 45.72,2.54
SOIC127P600X175-8N = smd 1.981 x 0.559: 1 -2.464,1.905; 2 -2.464,0.635; 3 -2.464,-0.635; 4 -2.464,-1.905; 5 2.464,-1.905; 6 2.464,-0.635; 7 2.464,0.635; 8 2.464,1.905
FIDUCIAL_1MM = smd 1 x 1: 1 0,0
TSW-104-02-S-Q = drill 1 pad 1.5 octagon: 1 3.81,-2.54; 2 3.81,2.54; 3 1.27,-2.54; 4 1.27,2.54; 5 -1.27,-2.54; 6 -1.27,2.54; 7 -3.81,-2.54; 8 -3.81,2.54

### Placement (x,y rotation side)
A_IA_TP  30.16,25.72 0 top
C1  30.1,36.96 0 bottom
C2  30.1,34.93 0 bottom
C3  56.52,24.13 180 bottom
C4  56.52,21.59 180 bottom
C5  57.91,11.68 180 top
C6  58.17,18.8 0 bottom
C7  58.17,16.76 0 bottom
C8  47.36,35.31 270 top
C9  47.37,43.56 90 top
C10  18.41,10.16 0 top
C11  18.41,12.7 0 top
C12  18.41,25.4 0 top
C13  18.41,27.94 0 top
C14  26.67,17.78 180 bottom
C15  57.15,41.91 90 top
C16  26.67,20.32 180 bottom
C17  46.36,23.49 180 bottom
C18  30.48,14.6 90 top
C19  30.48,23.49 270 top
C20  46.36,20.95 180 bottom
C21  37.08,34.54 0 top
C22  42.29,46.23 0 top
C23  33.02,14.6 270 top
C24  33.02,23.49 90 top
C25  35.56,14.6 90 top
C26  35.56,23.49 270 top
C27  54.61,36.83 180 bottom
C28  54.61,34.29 180 bottom
C29  31.75,6.98 0 top
C30  31.75,31.12 0 top
C31  36.2,6.98 180 top
C32  36.2,31.12 180 top
C33  24.13,13.97 270 bottom
C34  38.1,10.16 270 top
C35  38.1,27.94 90 top
C36  21.59,13.97 270 bottom
C37  55.56,47.62 0 top
C38  46.25,47.62 90 top
C39  32.67,44.8 0 bottom
C40  32.68,46.85 0 bottom
C41  54.61,12.06 0 bottom
C42  54.61,14.6 0 bottom
C43  57.78,24.13 0 top
C44  57.78,21.59 0 top
C45  46.99,5.71 0 top
C46  42.55,5.71 180 top
C47  42.93,34.29 0 bottom
C48  42.93,36.32 0 bottom
D3  20.7,44.45 0 top
D4  20.7,35.88 0 top
D5  52.07,5.71 270 bottom
D6  41.91,20.7 90 top
D7  41.91,17.4 90 top
IC1  25.4,13.97 270 top
IC2  25.4,24.13 270 top
JP1  57.91,8.64 0 top
JP2  20.37,47.62 0 top
JP3  26.62,47.62 0 top
JP4  22.86,31.75 0 top
JP5  28.58,31.75 0 top
R1  16.26,44.45 0 top
R2  16.26,39.37 0 top
R3  16.26,36.83 0 top
R4  16.26,31.75 0 top
R5  16.26,41.91 0 top
R6  16.26,34.29 0 top
R7  14.6,11.43 90 bottom
R8  17.14,11.43 270 bottom
R9  13.33,27.3 270 bottom
R10  16.51,26.67 0 bottom
R11  47.37,39.5 270 top
R12  57.15,37.47 270 top
R13  24.77,8.89 90 top
R14  27.3,8.89 270 top
R15  22.86,20.32 0 top
R16  27.3,20.32 0 top
R17  49.58,35.31 90 top
R18  49.57,43.56 270 top
R19  25.4,17.78 0 top
R20  25.4,27.94 0 top
R21  53.34,34.93 180 top
R22  49.57,39.5 90 top
R23  31.75,17.78 180 top
R24  31.75,20.32 180 top
R25  36.2,17.78 0 top
R26  36.2,20.32 0 top
R27  38.1,14.6 90 top
R28  38.1,23.49 270 top
R29  30.48,10.16 270 top
R30  30.48,27.94 90 top
R31  33.02,10.16 90 top
R32  33.02,27.94 270 top
R33  35.56,10.16 270 top
R34  35.56,27.94 90 top
R35  41.27,29.21 0 top
R36  41.27,8.89 0 top
R37  46.36,20.32 0 top
R38  46.36,16.83 0 top
R39  45.72,29.84 0 top
R40  45.72,8.26 0 top
R41  51.44,47.62 180 top
R42  48.39,47.64 90 top
R43  49.53,24.77 90 top
R44  48.9,13.33 270 top
R45  48.9,29.21 90 top
R46  48.9,8.89 270 top
R47  51.44,10.79 270 top
R48  52.07,27.94 90 top
R49  52.07,13.97 180 top
R50  52.7,24.13 180 top
R51  53.97,10.79 270 top
R52  54.61,27.3 90 top
R53  57.15,45.09 0 top
R54  52.7,45.09 0 top
R55  49.53,8.89 90 bottom
SV1  25.4,40.01 270 top
SW1  5.71,24.13 180 top
U1  30.73,40.01 270 top
U2  -5.08,0 0 top
U3  57.15,16.51 270 top
U4  53.34,40.01 90 top
U5  43.81,12.7 0 top
U6  43.81,25.4 180 top
U7  17.14,19.05 270 top
U8  42.93,40.01 270 top
U9  36.83,40.01 90 top
U10  51.44,19.05 270 top
U$1  2.92,2.92 0 top
U$2  60.2,49.28 0 top
U$3  2.92,50.16 0 bottom
U$4  2.92,2.92 0 bottom
U$5  2.96,50.18 0 top
U$6  60.2,49.28 0 bottom
U$7  [FIREBALL]  9.03,4.92 0 top
V_IA_TP  30.16,12.38 0 top
X1  8.75,38.1 90 top

### Tracks (layer width: path | path; a pad name or v marks a point on that pad's centre or on a via)
+3V3  (via drill 0.41 pad 0.25)
  Top 0.254: IC2.7 26.67,24.77 v26.04,25.4 25.4,26.03 25.4,28.73 24.92,29.21 21.59,29.21 20.95,29.84 | v26.04,15.24 26.67,14.6 IC1.7 | R53.2 58.42,44.82 58.42,34.04 58.17,33.78 v58.17,33.53 | v57.15,31.12 v57.15,26.03 57.15,24.34 C43.1 C44.1 56.52,21.17 U3.3 56.52,17.78 55.32,16.59 | R52.2 v54.61,31.12 47.62,31.12 v46.99,31.59 | U6.4 v45.09,25.4 | U10.8 55.32,16.59 | U5.4 v42.39,12.7 | 55.32,16.59 v55.25,16.51 | R51.2 v53.97,8.26 52.36,8.26 50.03,5.92 50.03,5.31 48.85,4.13 33.97,4.13 v33.02,5.08 | D3.2 21.8,43.35
  Top 0.305: 20.95,29.84 20.95,33.66 21.59,34.29 21.59,34.72 D4.2 D3.2
  Bottom 0.254: C4.1 C3.1 55.67,24.55 v57.15,26.03 | v54.61,31.12 v57.15,31.12 57.15,32.51 v58.17,33.53 | v42.39,12.7 40.64,12.7 v33.02,5.08 U2.3V | v53.97,8.26 55.46,9.74 C41.1 C42.1 55.46,16.3 v55.25,16.51 | v26.04,15.24 26.04,17.56 C14.1 C16.1 25.82,25.19 v26.04,25.4 33.66,33.02 45.09,33.02 45.09,31.59 | C20.1 C17.1 45.51,24.98 v45.09,25.4 45.09,31.59 | v46.99,31.59 45.09,31.59
+5V  (via drill 0.41 pad 0.25)
  Top 0.254: v19.05,8.26 19.05,5.71 20.32,4.45 31.12,4.45 U2.5V | v52.7,38.73 53.34,38.1 U4.4 53.34,33.66 52.7,33.02 45.47,33.02 | 45.47,33.02 v30.48,33.02 29.84,32.39 29.84,30.48 v27.94,28.58 | 19.1,15.5 U7.14 19.1,15.4 v19.69,14.82 | U8.14 44.88,36.4 v45.47,35.81 45.47,33.02 | v34.81,44.29 34.89,42.86 U9.14 34.87,42.75 34.04,41.91 34.04,38.51 U1.14 32.69,35.89 v32.77,35.81
  Bottom 0.254: 19.69,14.92 19.69,15.87 22.86,19.05 22.86,23.49 v27.94,28.58 | 19.69,14.92 v19.69,14.82 | v19.69,14.82 19.69,8.89 v19.05,8.26 | v52.7,38.73 52.7,37.89 C27.1 C28.1 | C33.1 C36.1 19.79,14.82 | 19.79,14.82 19.69,14.92 | v19.69,14.82 19.79,14.82 | v45.47,35.81 44.28,35.81 C48.1 C47.1 | C40.1 33.52,46.84 C39.1 34.02,44.29 v34.81,44.29 | v32.77,35.81 32.09,35.81 C1.1 C2.1 30.48,34.46 v30.48,33.02
ATR_CMP_DETECT  (via drill 0.41 pad 0.25)
  Top 0.254: U10.1 53.34,23.86 R50.1 53.7,25.4 R52.1 55.88,27.58 v55.88,32.39
  Bottom 0.254: U2.D0 58.42,34.93 v55.88,32.39
ATR_CMP_REF  (via drill 0.41 pad 0.25)
  Top 0.254: U10.2 52.07,22.23 52.7,22.86 52.7,25.4 53.34,26.03 53.34,29.84 52.86,30.32 v52.55,30.32 | R42.1 46.39,46.64 C38.1 46,46.52 46,44.92 45.97,44.89 v45.97,39.88
  Bottom 0.254: v52.55,30.32 52.55,30.96 45.97,37.53 v45.97,39.88
ATR_CMP_REF_PWM
  Top 0.254: R42.2 48.39,50.67 U2.D4
ATR_GND_CTRL
  Top 0.254: U2.D11 33.53,46.23 33.53,39.88 32.03,38.38 U1.13
ATR_PACE_CTRL  (via drill 0.41 pad 0.25)
  Top 0.254: U9.6 38.12,38.84 v37.59,39.37
  Bottom 0.254: 37.47,49.91 U2.D8 37.59,49.78 v37.59,39.37
ATR_RECT_SIGNAL  (via drill 0.41 pad 0.25)
  Top 0.254: R45.2 47.99,30.21 47.62,29.84 47.62,27.94 47.04,27.36 U6.7 | R48.2 51.86,28.94 50.59,30.21 v50.53,30.21 50.03,30.21 R45.2 | 48.94,30.16 R45.2 | U2.A3 51.96,3.92 v49.73,3.92
  Bottom 0.254: v49.73,3.92 48.03,5.62 48.03,18.92 50.53,21.42 v50.53,30.21
ATR_RING  (via drill 0.41 pad 0.25)
  Top 0.254: R6.2 R3.2 17.89,36.2 19.43,36.2 20.21,36.98 D4.3 | U7.1 19.1,20.27 v19.69,19.69
  Top 0.305: v18.8,33.53 18.03,34.29 R6.2
  Bottom 0.254: v19.69,19.69 20.95,20.95 20.95,27.3 19.69,28.58
  Bottom 0.305: 19.69,28.58 18.8,29.46 v18.8,33.53
ATR_RING_OUT  (via drill 0.41 pad 0.25)
  Top 0.254: U8.3 43.59,43.79 43.18,44.2 40.39,44.2 39.88,43.69 39.88,42.16 39.12,41.4 38.61,41.4 38.1,41.91 | 38.1,41.91 38.1,42.82 U9.9 | v36.83,40.64 38.1,41.91 | U1.2 32.03,41.43 v32,41.4 30.61,40.01 26.67,40.01 SV1.3
  Bottom 0.254: v36.83,40.64 35.81,41.66 34.04,41.66 33.78,41.4 v32,41.4 | SV1.3 22.86,36.2 JP4.1
ATR_SIGNAL  (via drill 0.41 pad 0.25)
  Top 0.254: C35.2 39.86,28.79 R35.1 | U6.9 U6.8 40.97,28.52 R35.1 | R39.1 44.45,29.84 43.81,30.48 | 43.81,30.48 40.64,30.48 40.01,29.84 40.01,29.48 R35.1 | 43.81,30.48 v43.18,31.12
  Bottom 0.254: U2.A0 45.09,2.54 43.18,4.45 v43.18,31.12
ATR_TIP_OUT
  Top 0.254: 28.58,34.93 33.15,34.93 34.04,35.81 34.04,37.85 34.54,38.35 35.05,38.35 35.54,37.87 U9.2 | 28.58,34.93 26.67,34.93 SV1.4 | JP5.1 28.58,34.93
FRONTEND_CTRL  (via drill 0.41 pad 0.25)
  Top 0.254: U7.13 U7.12 17.78,15.58 17.78,14.6 v18.41,13.97 | U7.5 U7.6 15.85,20.34 v15.87,20.32
  Bottom 0.254: U2.D13 21.97,48.9 19.05,48.9 | 16.51,24.13 15.87,23.49 v15.87,20.32 15.24,19.69 15.24,18.73 15.56,18.41 16.83,18.41 18.1,17.15 18.1,14.29 v18.41,13.97
  Bottom 0.305: 19.05,48.9 16.51,46.36 16.51,24.13
GND  (via drill 0.41 pad 0.25)
  Top 0.254: 22.86,12.01 IC1.4
  Bottom 0.254: C4.2 C3.2
  other vias: 24.13,47.62 45.14,45.24 54.29,40.96 52.39,41.47 55.69,38.67 35.24,48.58 32.19,48.83 28.89,47.31 17.46,49.21 13.4,40.96 13.4,37.78 13.4,35.24 8.57,31.43 23.08,39.5 19.59,44.77 13.49,31.69 19.62,32.26 18,43.18 39.69,27.3 39.05,19.05 29.21,17.46 29.21,7.62 41.27,31.43 44.13,27.94 57.15,34.93 59.03,26.86 53.34,19.05 46.86,18.43 56.2,26.51 54.93,4.19 54.86,6.29 22.54,10.67 25.72,5.71 21.27,5.71 36.83,4.92 13.33,17.46 15.24,24.57 5.84,26.1 12.83,44.51 13.97,47.31 26.67,30.16 24.96,33.21 39.62,49.09 39.69,10.16 16.43,4.84 49.43,6.48 23.02,27.78 51.45,8.55 14.13,21.76 48.44,37.38 54.86,32.13 45.66,36.79 39.95,33.86 40.46,40.97 30.16,48.32 27.62,35.88 18.86,39.37 16.7,8.38 20,22.35 3.24,46.74 2.48,31.75
  pour Top: -20.15,64.71 -20.15,-5.22 85.31,-5.22 85.31,68.47 -20.28,68.47
  pour Bottom: -17.6,66.85 -17.6,-3.2 81.95,-3.2 81.95,67.12 -15.72,67.12
N$1
  Top 0.254: R13.2 24.77,12.7 24.13,13.33 IC1.3 21.59,13.33 20.95,12.7 20.95,11.85 C10.2
N$2
  Top 0.254: R14.1 26.04,11.16 26.04,13.97 25.4,14.6 IC1.2 21.17,14.6 C11.2
N$3
  Top 0.254: IC1.6 30.06,13.33 | 30.06,13.33 C18.1 | V_IA_TP.TP 30.06,12.49 30.06,13.33
N$4
  Top 0.254: R19.1 24.4,16.15 24.13,15.87 IC1.1
N$5
  Bottom 0.254: R7.2 9.87,12.43 SW1.7
N$6
  Top 0.254: R23.2 30.75,15.72 C18.2 C23.1
N$7
  Top 0.254: C23.2 C25.1 37.95,13.76 R27.1
N$8  (via drill 0.41 pad 0.25)
  Top 0.254: C11.1 16.48,13.78 U7.10 16.51,15.62 v16.51,17.62
  Bottom 0.254: R8.1 17.14,16.99 v16.51,17.62
N$9
  Top 0.254: R16.1 26.04,20.59 26.04,24.13 25.4,24.77 IC2.2 21.59,24.77 20.95,25.4 20.95,26.25 C13.2
N$10
  Top 0.254: C29.1 30.48,7.4 R29.2 R31.1
N$11
  Top 0.254: R31.2 R33.1 37.95,11.16 C34.1
N$12  (via drill 0.41 pad 0.25)
  Top 0.254: C13.1 17.14,27.94 17.3,28.1 17.3,28.7 v17.3,29.84 | v17.78,20.64 17.78,22.48 U7.3
  Bottom 0.254: v17.78,20.64 19.05,21.59 19.05,25.13 R10.1 17.51,29.64 v17.3,29.84
N$13
  Top 0.254: R37.1 44.34,20.32 D6.2 43.58,22.23 46.99,22.23 48.1,23.34 48.1,23.81 47.81,24.1 U6.2 43.84,24.1 43.18,24.77 43.18,28.3 R35.2
N$15
  Bottom 0.254: SW1.10 11.54,18.53 13.33,20.32 R9.2
N$16
  Top 0.254: R20.1 24.4,26.3 24.13,26.03 IC2.1
N$17
  Top 0.254: R20.2 26.4,26.3 26.67,26.03 IC2.8
N$18
  Top 0.254: C24.1 C19.2 30.48,20.59 R24.2
N$19
  Top 0.254: U6.1 43.13,23.44 40.64,20.95 40.64,20.87 D6.3
N$20
  Top 0.254: R19.2 26.4,16.15 26.67,15.87 IC1.8
N$21
  Top 0.254: R15.2 24.77,21.23 24.77,22.86 24.13,23.49 IC2.3 21.17,23.49 C12.2
N$24  (via drill 0.41 pad 0.25)
  Top 0.254: R12.1 C15.1 56.38,40.29 v52.48,40.29 | U8.1 44.88,41.66 v45.26,41.27
  Bottom 0.254: v52.48,40.29 51.31,40.29 50.32,41.27 v45.26,41.27
N$25
  Top 0.254: U9.4 36.83,36.32 36.58,36.07 36.07,36.07 | 36.07,36.07 35.05,36.07 34.8,36.32 34.8,37.08 U9.1 | C21.1 36.23,35.9 36.07,36.07
N$26  (via drill 0.41 pad 0.25)
  Top 0.254: v51.05,35.72 51.38,36.05 U4.1 51.31,37.24 51.31,38.1 50.91,38.5 R22.1
  Bottom 0.254: v51.05,35.72 51.05,34.04 53.34,31.75 53.34,26.67 52.07,25.4 52.07,21.59 49.53,19.05 R55.2
N$27
  Top 0.254: D7.3 40.81,16.98 42.94,14.84 46.37,14.84 46.61,14.6 U5.14
N$28
  Top 0.254: R28.2 39.05,23.44 39.37,23.44 | 39.37,23.44 U6.14 U6.13 | R30.1 30.48,26.67 31.12,26.03 38.73,26.03 39.37,25.4 39.37,23.44
N$29
  Bottom 0.254: SW1.6 SW1.12
N$30
  Top 0.254: R28.1 35.71,24.49 C26.1 C24.2
N$31
  Top 0.254: U8.2 44.22,43.92 43.43,44.7 41.15,44.7 | 41.15,44.7 39.88,44.7 38.86,43.69 38.86,42.93 U9.8 38.79,43.51 38.35,43.94 37.08,43.94 36.83,43.69 U9.11 | C22.1 41.44,45 41.15,44.7
N$32
  Top 0.254: R25.2 37.2,17.09 | 37.2,17.09 C25.2 | 37.2,17.09 38.79,17.09 40.64,15.24 41.91,15.24 42.55,14.6 42.55,13.97 41.91,13.33 41,13.33 U5.3
N$33
  Top 0.254: 39.37,14.66 U5.1 U5.2 | 39.37,14.66 39.05,14.66 R27.2 | R29.1 30.48,11.43 31.12,12.06 38.73,12.06 39.37,12.7 39.37,14.66
N$34
  Top 0.254: U3.8 59.06,11.98 C5.1
N$36  (via drill 0.41 pad 0.25, 0.41 pad 0.3)
  Top 0.254: R33.2 37.05,7.68 C31.1 v39.37,6.98 | U5.5 41.94,12.04 42.55,11.43 v42.39,10.79
  Bottom 0.254: v39.37,6.98 42.55,10.16 v42.39,10.79
N$40
  Top 0.254: C30.1 30.9,29.36 R30.2 R32.1
N$41
  Top 0.254: U10.3 50.8,23.23 R50.2 | 51.44,24.49 R50.2 | R48.1 52.07,24.49 R50.2
N$42
  Top 0.254: R32.2 R34.1 37.95,26.94 C35.1
N$44
  Top 0.254: D6.1 43.75,19.75 44.45,19.05 46.36,19.05 46.99,19.69 46.99,19.95 R37.2 47.36,21.59 R43.1
N$45
  Top 0.254: C26.2 35.77,22.65 37.47,20.95 | 37.47,20.95 37.47,20.59 R26.2 | 37.47,20.95 38.73,20.95 40.64,22.86 41.91,22.86 42.55,23.49 42.55,24.13 41.91,24.77 41,24.77 U6.12
N$46
  Top 0.254: R47.1 51.44,13.6 R49.2 51.07,14.33 49.53,15.87 U10.5
N$48  (via drill 0.41 pad 0.25)
  Top 0.254: R34.2 37.05,30.43 C32.1 v39.37,31.12 | U6.10 42.52,26.06 v42.39,26.03
  Bottom 0.254: v42.39,26.03 42.39,27.94 v39.37,31.12
N$49
  Top 0.254: 48.6,26.7 U6.6 46.63,26.67 45.4,26.67 45.09,26.99 45.09,27.3 46.72,28.94 R39.2 | 48.6,26.7 R43.2 | R45.1 48.6,27.91 48.6,26.7
N$51
  Top 0.254: SW1.3 SW1.9
N$53
  Top 0.254: 44.72,39.37 41.91,39.37 40.97,38.43 U8.8 | C8.1 47.36,38.74 | 47.36,38.74 R11.2 | 47.36,38.74 45.35,38.74 44.72,39.37 | U8.4 42.93,42.16 44.2,40.89 44.2,39.89 44.72,39.37
N$54
  Top 0.254: IC2.6 29.21,23.49 29.84,24.13 30.27,24.13 C19.1 30.48,25.4 A_IA_TP.TP
N$55
  Top 0.254: U4.9 U4.8
N$56
  Top 0.254: R12.2 56.45,37.16 U4.7
N$57
  Top 0.254: U4.3 52.7,37.14 52.7,35.29 R21.2 | 51.97,34.56 R21.2 | R17.1 51.72,34.31 R21.2
N$58
  Top 0.254: U4.2 52.05,38.08 52.07,38.1 51.44,38.73 51.44,41.27 49.9,42.82 R18.2 R22.2
N$59
  Top 0.254: C9.2 47.14,44.82 | 47.52,44.82 C9.2 | R18.1 47.52,44.56 C9.2
N$60
  Top 0.254: R17.2 49.54,36.56 48.51,35.54 48.51,35.05 47.92,34.46 C8.2
N$61
  Top 0.254: U4.14 U4.13
N$62
  Top 0.254: R53.1 R54.2 54,44.79 54,44.45 | 54,44.45 U4.10 | U4.12 52.7,42.88 52.7,43.82 53.34,44.45 54,44.45
N$82
  Top 0.254: X1.7 12.72,34.29 R4.1
  Top 0.406: X1.8 X1.7
N$83
  Top 0.254: R2.1 X1.3
  Top 0.406: X1.4 X1.3
N$84
  Top 0.254: R3.1 X1.5
  Top 0.406: X1.6 X1.5
N$85
  Bottom 0.254: R8.2 R7.1 14.24,10.79 8.26,10.79 7.26,11.78 SW1.1
N$86
  Top 0.254: 14.99,44.45 R1.1 12.72,41.91 X1.1
  Top 0.406: X1.2 X1.1
N$88
  Top 0.254: SW1.8 14.04,14.53 14.6,13.97 15.24,13.97 15.87,14.6 15.87,15.58 U7.9
N$89
  Top 0.254: U7.2 18.41,22.52 18.41,23.49 18.1,23.81 14.6,23.81 11.32,20.53 SW1.11
N$90
  Bottom 0.254: SW1.4 6.35,19.45 6.35,23.49 11.16,28.3 R9.1 | R9.1 13.7,27.94 | R10.2 13.87,28.3 R9.1
N$91  (via drill 0.41 pad 0.25)
  Top 0.254: D7.2 44.15,18.35 R38.1 45.4,17.19 v45.4,18.26 | R36.2 43.81,10.43 43.81,13.33 44.48,13.99 v45.09,13.99 U5.13
  Bottom 0.254: v45.4,18.26 45.09,17.94 v45.09,13.99
N$92
  Top 0.254: C12.1 9.53,25.4 8.57,24.45 8.57,21.84 SW1.5
N$93
  Top 0.254: C10.1 10.16,10.16 8.57,11.75 8.57,13.22 SW1.2
N$94
  Top 0.254: D7.1 43.88,16.45 44.61,15.72 46.83,15.72 | 46.83,15.72 47.62,16.51 47.62,16.88 R38.2 | R44.1 48.53,14.33 46.83,15.72
N$96
  Top 0.254: R44.2 R46.1 47.38,11.4 U5.9 46.63,11.43 45.4,11.43 45.09,11.11 45.09,10.79 46.72,9.16 R40.2
PACE_CHARGE_CTRL  (via drill 0.41 pad 0.25)
  Top 0.254: U8.13 44.22,38.38 v44.45,38.61
  Bottom 0.254: v44.45,38.61 44.45,49.53 U2.D5
PACE_GND_CTRL
  Top 0.254: U2.D10 35.54,46.76 U9.13 35.56,42.82 35.56,41.66 34.8,40.89 34.8,40.54 37.49,37.85 U9.5
PACING_REF_PWM  (via drill 0.41 pad 0.25)
  Top 0.254: U4.5 53.97,37.19 53.97,38.73 v54.48,39.24
  Bottom 0.254: v54.48,39.24 53.34,40.39 U2.D2
V_GND  (via drill 0.41 pad 0.25)
  Top 0.254: U3.1 59.06,21.17 C44.2 C43.2 58.64,25.69 v58.29,26.03 | R26.1 R25.1 34.29,17.78 | R23.1 32.75,19.05 | 32.75,19.05 R24.1 34.29,20.32 | R26.1 35.56,20.32 | IC2.5 28.3,21.92 R16.2 28.3,19.95 29.21,19.05 | 29.21,19.05 32.75,19.05 | R15.1 21.86,19.41 22.23,19.05 29.21,19.05 | R13.1 R14.2 | IC1.5 28,11.37 28.58,10.79 28.58,9.16 R14.2 | 34.29,20.32 R26.1 | 33.97,31.12 C32.2 | C29.2 33.97,6.98 | 33.97,6.98 C31.2 | U5.10 45.43,12.04 v45.09,12.38 | U6.5 44.79,26.06 44.45,26.4 | U5.12 45.43,13.36 45.09,13.02 v45.09,12.38 | R14.2 29.48,5.71 31.75,5.71 32.38,6.35 32.38,6.77 C29.2 | 33.97,6.98 33.97,7.94 34.29,8.26 v34.29,10.16 | v34.29,14.6 34.29,17.78 | 34.29,17.78 32.38,17.78 | v34.29,27.94 34.29,29.84 33.97,30.16 33.97,31.12 | v34.29,23.49 34.29,20.32 | v45.09,12.38 44.45,11.75 44.45,10.79 45.72,9.53 45.72,7.3 45.4,6.98 | 45.72,32.39 45.72,28.58 44.45,27.3 44.45,26.4 | C30.2 33.97,31.12 | 33.97,31.12 33.97,32.07 34.29,32.39 45.72,32.39 | 45.4,6.98 44.45,6.98 | 44.45,6.98 40.64,6.98 39.37,5.71 33.87,5.71 C29.2 | 54.64,35.27 R21.1 54.64,35.22 U4.6 | C46.1 43.4,5.93 44.45,6.98 | C45.1 46.14,6.25 45.4,6.98 | U6.3 44.48,24.74 44.13,25.08 v44.13,26.03 44.13,26.09 44.45,26.4 | 55.88,34.29 53.97,32.39 45.72,32.39
  Top 0.406: v58.29,26.03 58.29,31.88 55.88,34.29 55.25,34.93 R21.1
  Bottom 0.254: v34.29,10.16 v34.29,14.6 | v34.29,27.94 v34.29,23.49 | v44.13,26.03 44.13,13.33 v45.09,12.38 | v58.29,26.03 58.29,25.78 58.67,25.4 58.67,20.49 59.02,20.14 C6.1 C7.1
VENT_CMP_DETECT
  Top 0.254: R51.1 53.97,13.06 R49.1 53.07,14.24 52.07,15.24 U10.7 | R51.1 54.34,11.43 54.59,11.68 | U2.D1 56.52,50.8 59.69,47.62 59.69,25.91 59.94,25.65 59.94,10.92 59.44,10.41 56.39,10.41 55.01,11.79 R51.1
VENT_CMP_REF  (via drill 0.41 pad 0.25)
  Top 0.254: R41.1 C37.1 54.71,48.36 55.25,48.9 57.15,48.9 59.12,46.93 59.12,33.21 v58.67,32.77 | v50.8,19.05 U10.6
  Bottom 0.254: v58.67,32.77 58.67,30.73 57.17,29.23 52.7,24.77 52.7,20.95 v50.8,19.05
VENT_CMP_REF_PWM
  Top 0.254: R41.2 50.44,50.44 U2.D3
VENT_GND_CTRL
  Top 0.254: U2.D12 30.07,47.14 U1.5
VENT_PACE_CTRL
  Top 0.254: U2.D9 36.17,48.67 U9.12
VENT_RECT_SIGNAL
  Top 0.254: U5.8 47.04,10.74 47.62,10.16 47.62,9.16 R46.2 49.53,7.89 R47.2 51.73,9.79 52.7,10.77 55.18,10.77 56.03,9.92 56.03,2.69 U2.A4
VENT_RING  (via drill 0.41 pad 0.25)
  Top 0.254: R5.2 R1.2 18.36,45.55 D3.3 20.87,45.72 | U7.8 15.19,18.2 v16.03,19.21
  Top 0.305: v18.8,41.91 R5.2
  Bottom 0.254: v16.03,19.21 16.99,19.21 19.05,17.15 19.69,17.15 22.23,19.69 22.23,27.3 20.95,28.58
  Bottom 0.305: 20.95,28.58 20.57,28.96 20.57,41.15 19.81,41.91 v18.8,41.91
VENT_RING_OUT  (via drill 0.41 pad 0.25)
  Top 0.254: U8.9 41.66,37.14 41.66,36.32 41.4,36.07 40.39,36.07 39.88,36.58 39.88,38.61 38.1,40.39 37.59,40.39 36.83,39.62 36.83,39.66 v35.69,40.8 36.29,41.4 36.83,41.4 37.49,42.06 U9.10 | U1.3 31.39,42.06 v30.48,41.15 28.07,41.15 SV1.1
  Bottom 0.254: v35.69,40.8 32.42,40.8 32,40.39 31.24,40.39 v30.48,41.15 | SV1.1 21.59,47.62 JP2.1
VENT_SIGNAL  (via drill 0.41 pad 0.25)
  Top 0.254: U5.6 U5.7 40.97,9.58 R36.1 | R36.1 38.52,8.89 C34.2 | R36.1 40.01,8.62 40.01,8.26 40.64,7.62 43.81,7.62 44.72,8.53 R40.1 44.72,9.26 v44.45,9.53
  Bottom 0.254: U2.A1 44.45,6.35 v44.45,9.53
VENT_TIP_OUT  (via drill 0.41 pad 0.25)
  Top 0.254: U9.3 36.17,38.09 v34.77,39.5
  Bottom 0.254: v34.77,39.5 27.18,39.5 SV1.2 28.45,44.32 28.45,46.23 27.05,47.62 JP3.1
Z_ATR_CTRL  (via drill 0.41 pad 0.25)
  Top 0.254: U8.5 42.27,41.55 v43.18,40.64
  Bottom 0.254: v43.18,40.64 U2.D6
Z_SIGNAL
  Bottom 0.254: R55.1 50.97,6.45 D5.3 50.8,5.54 U2.A2
Z_VENT_CTRL  (via drill 0.41 pad 0.25)
  Top 0.254: U8.6 41.63,40.92 v41.91,40.64
  Bottom 0.254: v41.91,40.64 41.91,49.53 U2.D7

### Text on the board
Bottom: jz oct-apr/15
_tsilk: V+ | A+ | V- | A- | R_HEART / PACING PINOUT | U8 | U1 | V+ | V- | U9 | A+ | U4 | A- | 3.3V ONLY | IC2 | x1 | ATR | U6 | U10 | Attenuation | U7 | U3 | IC1 | U5 | VENT | x100 | GND | pacemaker_v2_rev2